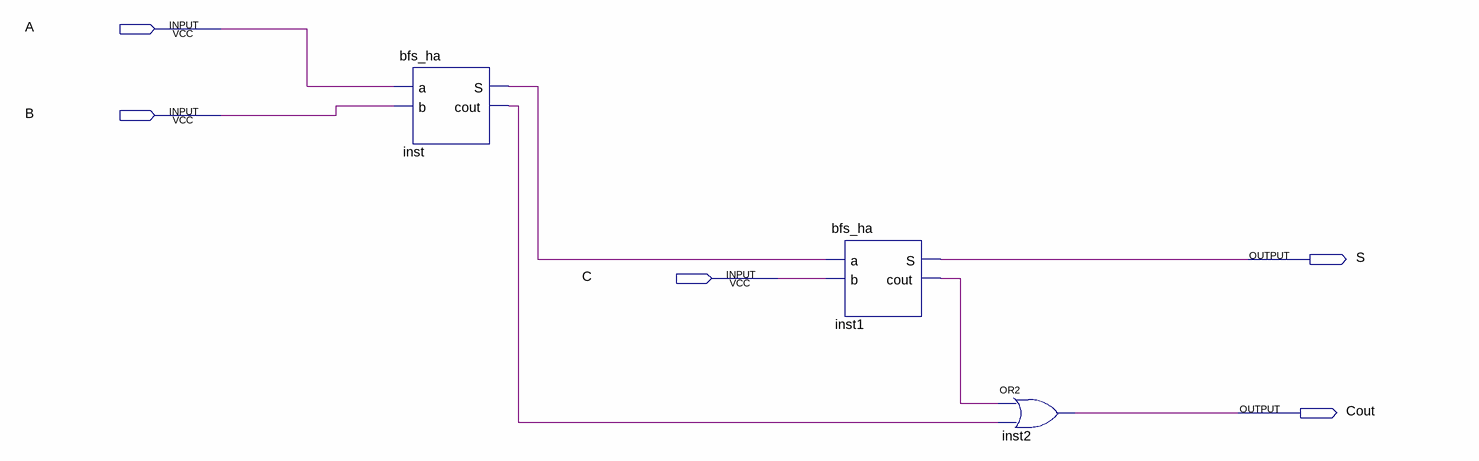
[diagram p0: schematic sheet]
// Quartus schematic bfs_fa.bdf as structural Verilog: 3 symbols, 5 pins
module bfs_fa (
  input  A,
  input  B,
  input  C,
  output S,
  output Cout
);

  wire inst1_cout, inst_cout, inst_s;

  bfs_ha inst (.a(A), .b(B), .S(inst_s), .cout(inst_cout));
  bfs_ha inst1 (.a(inst_s), .b(C), .S(S), .cout(inst1_cout));
  or inst2 (Cout, inst1_cout, inst_cout);
endmodule
